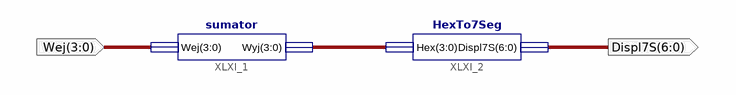
[diagram p0: schematic sheet 1]
// Xilinx ISE schematic sumator_z_wyswietlaczem.sch (xc9500xl) as structural Verilog: 2 symbols, 2 ports
module sumator_z_wyswietlaczem (
  input  [3:0] Wej,
  output [6:0] Displ7S
);

  wire [3:0] XLXN_1;

  sumator XLXI_1 (.Wej(Wej), .Wyj(XLXN_1));
  HexTo7Seg XLXI_2 (.Hex(XLXN_1), .Displ7S(Displ7S));
endmodule
